# Altium project DCDC.PrjPcb (part 9 of 9)
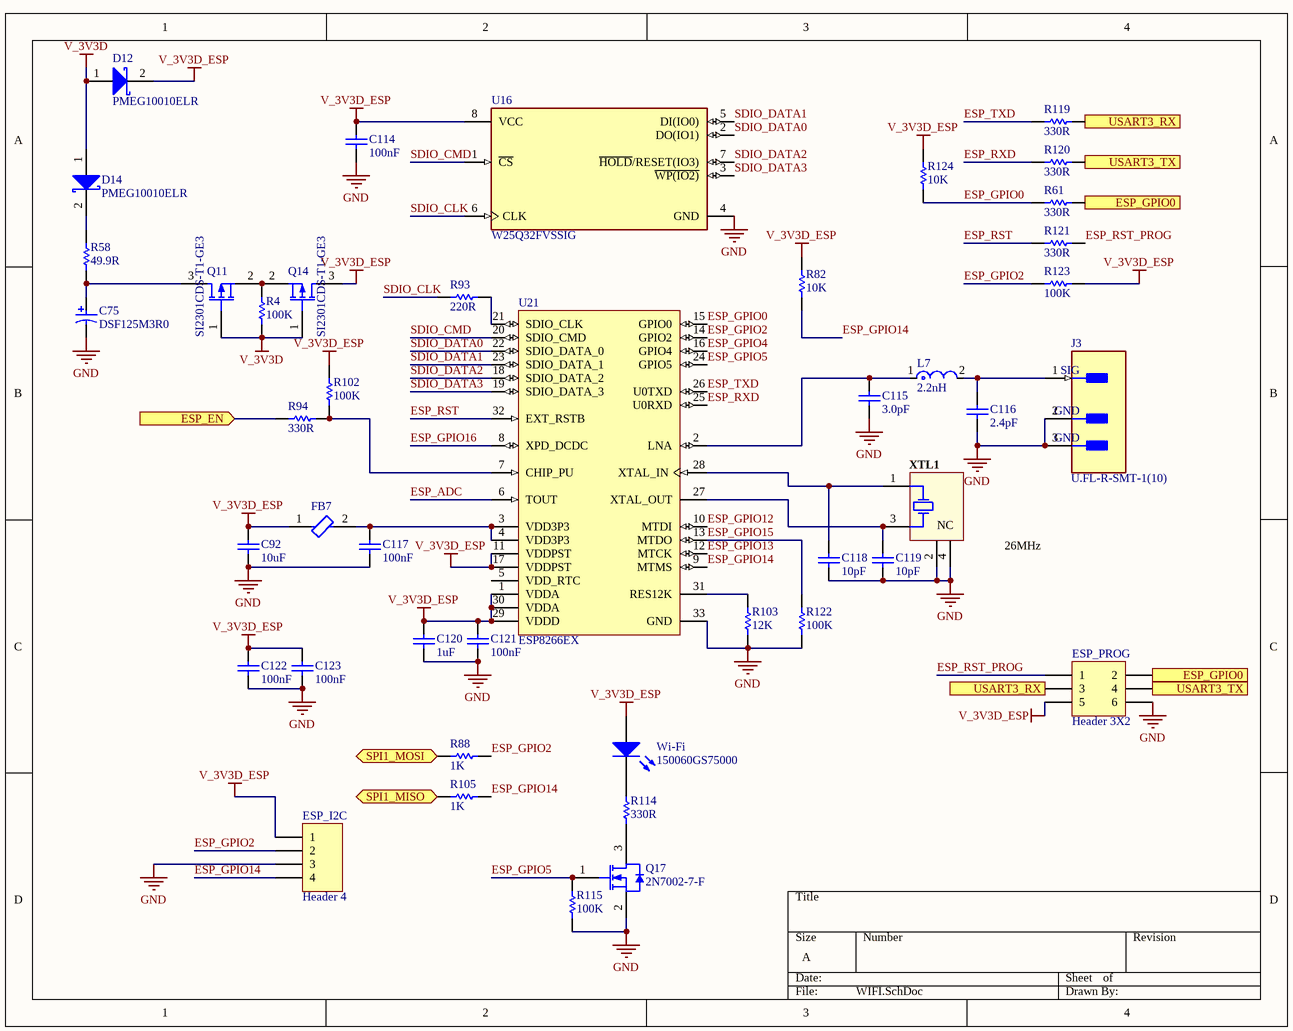
[diagram p15: WIFI.SchDoc]

## Sheet WIFI.SchDoc (continued)

### Library data of the parts
C75 = CMP-1665-00015-4: Aluminum Electrolytic Capacitor (Radial Lead Type), 100 uF, 35 V, -40 to 85 degC, 2-Pin THD, RoHS, Bulk; Manufacturer: Panasonic; Voltage Rating: 35 V; PackageReference: Radial; ComponentLink2URL: http://industrial.panasonic.com/cdbs/www-data/pdf/RDF0000/ABA0000C1047.pdf; DatasheetVersion: 03/2016; REACH SVHC: No SVHC; Mounting Technology: Through Hole; ComponentLink2Description: Datasheet; Packaging: Bulk; Lead Pitch: 2.5 mm; Height: 11.2 mm; Pins: 2; RoHSCompliant: true; Mount: Through Hole; Package Quantity: 200; Min Operating Temperature: -40 degC; Max Operating Temperature: 85 degC; PackageDescription: 2-Pin Through Hole Device, Dia 6.3 mm, Body Length 11.2 mm; ComponentLink1Description: Manufacturer URL; Length: 11.2 mm; ComponentLink1URL: http://www.panasonic.com/; Parameter 1: *; JLCPCB Part #: *
C92 = CMP-2007-03395-1: X5R 25V ±10% 10uF 0805 Multilayer Ceramic Capacitors MLCC - SMD/SMT ROHS; Part Number: GRM21BR71A106KE51L; Manufacturer: Murata; Parameter 1: *; JLCPCB Part #: C15850
C114 = CAP: X7R 100nF ±10% 50V 0603 Multilayer Ceramic Capacitors MLCC - SMD/SMT ROHS; Part Number: GCM188R72A104KA64D; Manufacturer: Murata; Manufacturer Part Number: CC0603KRX7R9BB104; Voltage Rating: 100V; Supplier 1: Arrow Electronics; Supplier Part Number 1: GCM188R72A104KA64D; RoHS: Yes; Category: Ceramic Capacitors; Mount: Surface Mount; Case/Package: 0603; Case Code (Imperial): 0603; Case Code (Metric): 1608; Min Operating Temperature: -55°C; Max Operating Temperature: 125°C; Tolerance: 10%; Packaging: Tape and Reel; Capacitance: 100nF; Dielectric: X7R; Termination: SMD/SMT; Voltage Rating (DC): 100V; Length: 1.6mm; Height: 0.8mm; Depth: 0.8mm; Radiation Hardening: No; ComponentLink1URL: https://datasheet.ciiva.com/17451/product-17451047.pdf?src-supplier=Avnet+Europe; ComponentLink1Description: https://datasheet.ciiva.com/17451/product-17451047.pdf?src-supplier=Avnet+Europe; ComponentLink2URL: https://datasheet.ciiva.com/26889/getdatasheetpartid-387765-26889164.pdf?src-supplier=Verical; ComponentLink2Description: https://datasheet.ciiva.com/26889/getdatasheetpartid-387765-26889164.pdf?src-supplier=Verical; Parameter 1: *; JLCPCB Part #: C14663
C115 = CMP-1034-00193-2: Part Number: GRM1555C1H2R4CA01D; Manufacturer: Murata; Capacitance: 2.4pF; Voltage Rating: 50V; Dielectric: C0G; Supplier 1: Digi-Key; Supplier Part Number 1: 490-5933-1-ND; Manufacturer Part Number: GRM1555C1H2R4CA01D; RoHS: Yes; Category: Ceramic Capacitors; Stock 1: 1106; Pricing 1: 1=0.10000, 10=0.03500, 50=0.01940, 100=0.01580, 500=0.01128, 1000=0.00886, 2500=0.00805, 5000=0.00741 (USD); Mount: Surface Mount; Case/Package: 0402; Case Code (Metric): 1005; Case Code (Imperial): 0402; Min Operating Temperature: -55°C; Max Operating Temperature: 125°C; Packaging: Tape and Reel; Package Quantity: 10000; Termination: SMD/SMT; Voltage Rating (DC): 50V; Series: GRM; Construction: Flat; Length: 1mm; Width: 0.02inch; Height: 0.5mm; Thickness: 0.022inch; Depth: 0.5mm; Radiation Hardening: No; Lead Free: Lead Free; RoHS Compliant: Yes; ComponentLink1URL: https://datasheet.ciiva.com/11614/product-11614787.pdf?src-supplier=Avnet; ComponentLink1Description: https://datasheet.ciiva.com/11614/product-11614787.pdf?src-supplier=Avnet; ComponentLink2URL: https://datasheet.ciiva.com/6271/grm1555c1h2r4ca01-01-6271124.pdf?src-supplier=Digi-Key; ComponentLink2Description: https://datasheet.ciiva.com/6271/grm1555c1h2r4ca01-01-6271124.pdf?src-supplier=Digi-Key; ComponentLink3URL: https://datasheet.ciiva.com/6271/partnumbering-e-01-6271126.pdf?src-supplier=Digi-Key; ComponentLink3Description: https://datasheet.ciiva.com/6271/partnumbering-e-01-6271126.pdf?src-supplier=Digi-Key; ComponentLink4URL: https://datasheet.ciiva.com/6271/partnumbering-e-01-6271129.pdf?src-supplier=Digi-Key; ComponentLink4Description: https://datasheet.ciiva.com/6271/partnumbering-e-01-6271129.pdf?src-supplier=Digi-Key; Parameter 1: *; JLCPCB Part #: *
C116 = CMP-1034-00193-2: Part Number: GRM1555C1H2R4CA01D; Manufacturer: Murata; Voltage Rating: 50V; Dielectric: C0G; Supplier 1: Digi-Key; Supplier Part Number 1: 490-5933-1-ND; Manufacturer Part Number: GRM1555C1H2R4CA01D; RoHS: Yes; Category: Ceramic Capacitors; Stock 1: 1106; Pricing 1: 1=0.10000, 10=0.03500, 50=0.01940, 100=0.01580, 500=0.01128, 1000=0.00886, 2500=0.00805, 5000=0.00741 (USD); Mount: Surface Mount; Case/Package: 0402; Case Code (Metric): 1005; Case Code (Imperial): 0402; Min Operating Temperature: -55°C; Max Operating Temperature: 125°C; Packaging: Tape and Reel; Capacitance: 2.4pF; Package Quantity: 10000; Termination: SMD/SMT; Voltage Rating (DC): 50V; Series: GRM; Construction: Flat; Length: 1mm; Width: 0.02inch; Height: 0.5mm; Thickness: 0.022inch; Depth: 0.5mm; Radiation Hardening: No; Lead Free: Lead Free; RoHS Compliant: Yes; ComponentLink1URL: https://datasheet.ciiva.com/11614/product-11614787.pdf?src-supplier=Avnet; ComponentLink1Description: https://datasheet.ciiva.com/11614/product-11614787.pdf?src-supplier=Avnet; ComponentLink2URL: https://datasheet.ciiva.com/6271/grm1555c1h2r4ca01-01-6271124.pdf?src-supplier=Digi-Key; ComponentLink2Description: https://datasheet.ciiva.com/6271/grm1555c1h2r4ca01-01-6271124.pdf?src-supplier=Digi-Key; ComponentLink3URL: https://datasheet.ciiva.com/6271/partnumbering-e-01-6271126.pdf?src-supplier=Digi-Key; ComponentLink3Description: https://datasheet.ciiva.com/6271/partnumbering-e-01-6271126.pdf?src-supplier=Digi-Key; ComponentLink4URL: https://datasheet.ciiva.com/6271/partnumbering-e-01-6271129.pdf?src-supplier=Digi-Key; ComponentLink4Description: https://datasheet.ciiva.com/6271/partnumbering-e-01-6271129.pdf?src-supplier=Digi-Key; Parameter 1: *; JLCPCB Part #: *
C117 C121-C123 = CMP-2008-02743-1: X7R 100nF ±10% 16V 0402 Multilayer Ceramic Capacitors MLCC - SMD/SMT ROHS; Manufacturer: AVX Interconnect / Elco; Part Number: 04026D104KAT2A; Voltage Rating: 6.3V; Dielectric: X5R; Supplier 1: Newark; Supplier Part Number 1: 34M9214; Manufacturer Part Number: 04026D104KAT2A; RoHS: Yes; Category: Ceramic Capacitors; Stock 1: 1436; Pricing 1: 10=0.02800, 25=0.02300, 50=0.01800, 100=0.01200, 250=0.01100, 500=0.00900, 1000=0.00700 (USD); Mount: Surface Mount; Case/Package: 0402; Case Code (Metric): 1005; Case Code (Imperial): 0402; Contact Plating: Tin,Matte; Dielectric Material: Ceramic; Min Operating Temperature: -55°C; Max Operating Temperature: 85°C; Package Quantity: 1; Packaging: Tape and Reel; Capacitance: 100nF; Tolerance: 10%; Voltage Rating (DC): 6.3V; Voltage: 6.3V; Termination: SMD/SMT; Series: -; Construction: Flat; Length: 1mm; Width: 0.02inch; Height: 0.56mm; Thickness: 0.022inch; Depth: 0.5mm; Radiation Hardening: No; REACH SVHC: No SVHC; Lead Free: Lead Free; RoHS Compliant: Yes; Parameter 1: *; JLCPCB Part #: C1525
C118 C119 = CMP-2008-04245-1: Part Number: GRM1555C1H100JA01D; Manufacturer: Murata; Material: Ceramic; Tolerance: 5%; Dielectric: C0G; Voltage Rating: 50V; Temperature Coefficient: 30ppm/°C; Supplier 1: Digi-Key; Supplier Part Number 1: 490-5921-1-ND; Manufacturer Part Number: GRM1555C1H100JA01D; RoHS: Yes; Category: Ceramic Capacitors; Stock 1: 1896512; Pricing 1: 1=0.10000, 10=0.01900, 50=0.01060, 100=0.00860, 500=0.00616, 1000=0.00484, 2500=0.00440, 5000=0.00405 (USD); Mount: Surface Mount; Case/Package: 0402; Number of Pins: 2; Case Code (Metric): 1005; Case Code (Imperial): 0402; Min Operating Temperature: -55°C; Max Operating Temperature: 125°C; Capacitance: 10pF; Packaging: Tape and Reel; Package Quantity: 10000; Voltage Rating (DC): 50V; Termination: SMD/SMT; Series: GRM; Construction: Flat; Voltage: 50V; Length: 1mm; Width: 0.02inch; Height: 0.5mm; Thickness: 0.022inch; Depth: 0.5mm; Radiation Hardening: No; RoHS Compliant: Yes; REACH SVHC: No SVHC; Lead Free: Lead Free; ComponentLink1URL: https://datasheet.ciiva.com/2989/product-2989280.pdf?src-supplier=Avnet; ComponentLink1Description: https://datasheet.ciiva.com/2989/product-2989280.pdf?src-supplier=Avnet; ComponentLink2URL: https://datasheet.ciiva.com/18184/getdatasheetpartid-307234-18184164.pdf?src-supplier=Verical; ComponentLink2Description: https://datasheet.ciiva.com/18184/getdatasheetpartid-307234-18184164.pdf?src-supplier=Verical; ComponentLink3URL: https://datasheet.ciiva.com/29200/453545-da-01-en-vs-kondensator-0402-29200107.pdf?src-supplier=Conrad; ComponentLink3Description: https://datasheet.ciiva.com/29200/453545-da-01-en-vs-kondensator-0402-29200107.pdf?src-supplier=Conrad; ComponentLink4URL: https://datasheet.ciiva.com/6271/partnumbering-e-01-6271158.pdf?src-supplier=Digi-Key; ComponentLink4Description: https://datasheet.ciiva.com/6271/partnumbering-e-01-6271158.pdf?src-supplier=Digi-Key; ComponentLink5URL: https://datasheet.ciiva.com/48671/product-48671350.pdf?src-supplier=Avnet; ComponentLink5Description: https://datasheet.ciiva.com/48671/product-48671350.pdf?src-supplier=Avnet; ComponentLink6URL: https://datasheet.ciiva.com/6271/partnumbering-e-01-6271159.pdf?src-supplier=Digi-Key; ComponentLink6Description: https://datasheet.ciiva.com/6271/partnumbering-e-01-6271159.pdf?src-supplier=Digi-Key; ComponentLink7URL: https://datasheet.ciiva.com/6271/partnumbering-e-01-6271068.pdf?src-supplier=Digi-Key; ComponentLink7Description: https://datasheet.ciiva.com/6271/partnumbering-e-01-6271068.pdf?src-supplier=Digi-Key; ComponentLink8URL: https://datasheet.ciiva.com/7828/1666664-7828812.pdf?src-supplier=Element14; ComponentLink8Description: https://datasheet.ciiva.com/7828/1666664-7828812.pdf?src-supplier=Element14; Parameter 1: *; JLCPCB Part #: *
C120 = CAP-NP-2: X5R ±10% 50V 1uF 0603 Multilayer Ceramic Capacitors MLCC - SMD/SMT ROHS; Manufacturer: AVX; Rated Voltage: 10V; Capacitance: 1µF; Datasheet Version: 10/2007; Mounting Technology: SurfaceMount; Datasheet URL: https://datasheet.ciiva.com/11787/0900766b80a45521-11787469.pdf; Tolerance (%): ±10%; Package Description: 2-Pin Surface Mount Device, Body 1.6 x 0.81 mm; Case Size/Dimension: 0603; Package Reference: 0603; Manufacturer URL: http://www.avx.com/; Dielectric: X5R; Parameter 1: *; JLCPCB Part #: C15849
D12 D14 = CMP-0303-00003-1: 1.0 A Surface Mount Schottky Barrier Rectifier, 40 V, -65 to 125 degC, 2-Pin SOD-123 Package, RoHS, Tape and Reel; PartNumber: 1N5819HW-7-F; Manufacturer: Diodes Inc; @ VR (V): 40; @ Terminal Temperature TT (degC): 90; Maximum Average Rectified Current IO (A): 1; Total Capacitance CT (pF): 50; Peak Forward Surge Current IFSM (A): 25; Forward Voltage Drop VF (V): 0.45; VR (RMS) (V): 28; RoHS: TRUE; ComponentLink2URL: http://www.diodes.com/datasheets/ds30217.pdf; PackageDescription: 2-Pin SOD-123, Body 2.7 x 1.55 mm, Pitch 3.7 mm; @ IF (A): 1; Operating and Storage Temperature Range: -65 to 125 degC; ComponentLink1Description: Manufacturer URL; ComponentLink2Description: Datasheet; ComponentLink1URL: http://www.diodes.com/; Mounting Technology: Surface Mount; DatasheetVersion: Rev. 15-2; PackageReference: SOD-123-2; Maximum Reverse Current IR (uA): 50; Peak Repetitive Reverse Voltage VRRM (V): 40; Packing: Tape and Reel; Parameter 1: *; JLCPCB Part #: C8598
ESP_I2C = Header 4: Header, 4-Pin; LatestRevisionDate: 17-Jul-2002; LatestRevisionNote: Re-released for DXP Platform.; Publisher: Altium Limited; Parameter 1: *; JLCPCB Part #: *
ESP_PROG = Header 3X2: Header, 3-Pin, Dual row; LatestRevisionDate: 17-Jul-2002; LatestRevisionNote: Re-released for DXP Platform.; Publisher: Altium Limited; Parameter 1: *; JLCPCB Part #: *
FB7 = CMP-0686-00187-4: Chip Ferrite Bead, 0402, 600Ω @ 100MHz, 0.52Ω, 25%, 300mA; DC Resistance-Max: 600mR; Number of Lines: 1; DC Resistance (DCR): 520mR; Shielding: Unshielded; Impedance: 600R; Material: Steel; Frequency: 100MHz; Lead Free: Lead Free; Max DC Current: 300mA; Test Frequency: 100MHz; Depth: 0.55mm; Length: 1mm; Case Code (Imperial): 0402; Packaging: Tape and Reel; Height: 0.5mm; Max Operating Temperature: 125°C; Military Standard: Not; REACH SVHC: No SVHC; Case Code (Metric): 1005; Series: BLM15AG_SN; Core Material: Ferrite; Termination: SMD/SMT; DC Current: 300mA; Package Quantity: 10000; Width: 0.5mm; RoHS Compliant: Yes; Min Operating Temperature: -55°C; Current Rating: 300mA; Case/Package: 0402; Number of Pins: 2; Radiation Hardening: No; Tolerance: 25%; Number of Circuits: 1; Max Current Rating: 300mA; Parameter 1: *; JLCPCB Part #: *
J3 = CMP-2000-05152-3: CONN U.FL RCPT STR 50 OHM SMD; Max Frequency: 6GHz; Connector Type: Coaxial; Body Plating: Silver; Body Material: Bronze; Impedance: 50R; Dielectric Material: Polymer; Insulation Resistance: 500MR; Gender: Male; Packaging: Cut Tape; Length: 3mm; Package Quantity: 2500; Termination: Solder; Lead Free: Lead Free; Series: U.FL; Min Operating Temperature: -40°C; Fastening Type: Snap; Contact Material: Brass; Orientation: Straight; Wire/Cable Type: Coaxial; Frequency: 6GHz; Contact Plating: Gold; Depth: 3.1mm; Weight: 0.001764oz; Max Operating Temperature: 90°C; Radiation Hardening: No; REACH SVHC: No SVHC; Mount: Surface Mount; Housing Color: Beige; Parameter 1: *; JLCPCB Part #: *
L7 = CMP-06042-005362-1: Multilayer type RF Inductor 1.6nH ±0.1nH 0.08Ω 1000mA 0402. LQP15MN1N6B02; Manufacturer: Murata; Manufacturer Part Number: LQP15MN1N6B02D; Self Resonant Frequency: 6GHz; Current: 300mA; Q Factor: 8; Core Material: Air; Test Frequency: 100MHz; Shielding: Unshielded; DC Resistance (DCR): 100mR; Number of Pins: 2; Mount: Surface Mount; Case Code (Metric): 1005; Min Operating Temperature: -55°C; Height - Seated (Max): 0.022inch; Termination: SMD/SMT; Packaging: Tape and Reel; Depth: 0.55mm; Max DC Current: 300mA; Case Code (Imperial): 0402; REACH SVHC: No SVHC; Width: 0.02inch; Height: 0.5mm; Package Quantity: 10000; Military Standard: Not; Lead Free: Lead Free; Inductance: 1.6nH; DC Current: 300mA; Radiation Hardening: No; Case/Package: 0402; Current Rating: 300mA; Max Operating Temperature: 125°C; Length: 1mm; Supplier 1: Digi-Key; Supplier Part Number 1: 490-6749-1-ND; RoHS: Yes; Category: Fixed Inductors; Stock 1: 8246; Pricing 1: 1=0.18000, 10=0.15800, 25=0.14040, 50=0.11920, 100=0.10520, 250=0.09644, 500=0.08768, 1000=0.07365, 2500=0.06313 (USD); Resistor Type: Thin Film; Series: LQP15M; Technology: THIN FILM; RoHS Compliant: Yes; ComponentLink1URL: https://datasheet.ciiva.com/30490/0900766b81256025-30490361.pdf?src-supplier=RSComponents; ComponentLink1Description: https://datasheet.ciiva.com/30490/0900766b81256025-30490361.pdf?src-supplier=RSComponents; ComponentLink2URL: https://datasheet.ciiva.com/6705/l0075s0084lqp15m-6705206.pdf?src-supplier=Digi-Key; ComponentLink2Description: https://datasheet.ciiva.com/6705/l0075s0084lqp15m-6705206.pdf?src-supplier=Digi-Key; ComponentLink3URL: https://datasheet.ciiva.com/4978/product-4978215.pdf?src-supplier=Mouser; ComponentLink3Description: https://datasheet.ciiva.com/4978/product-4978215.pdf?src-supplier=Mouser; ComponentLink4URL: https://datasheet.ciiva.com/6705/l0075s0084lqp15m-6705209.pdf?src-supplier=Digi-Key; ComponentLink4Description: https://datasheet.ciiva.com/6705/l0075s0084lqp15m-6705209.pdf?src-supplier=Digi-Key; Parameter 1: *; JLCPCB Part #: *
Q11 Q14 = CMP-1099-00031-1: 0.112Ω 2.8A,4.5V 1V 250uA 3.1A 0.86W 20V P Channel SOT-23(SOT-23-3) MOSFETs ROHS; Manufacturer: Infineon; PartNumber: BSS83P; RDS (on) (max): 2,000Â mOhm; VGS(th) (min): -1Â V; VDS (max): -60Â V; Packing: Reel; VGS(th) (max): -2Â V; IDpuls (max): -1.32Â A; Green: TRUE; ID (max): -0.33Â A; QG: 2.38Â nC; Rth: 350Â K/W; RDS (on) (max) (@4.5V): 3,000Â mOhm; Pto t (max): 0.36Â W; PackageDescription: 3-Pin Small Outline Transistor Package, 2.9 x 1.3 mm Body, 0.95 mm Pitch; ComponentLink1Description: Manufacturer URL; Mounting Technology: Surface Mount; ComponentLink1URL: http://www.infineon.com/; ComponentLink3Description: Package Specification; PackageReference: PG-SOT23; Halogen-free: TRUE; ComponentLink3URL: http://www.infineon.com/dgdl/SOT23-Package_Overview.pdf?folderId=db3a30431936bc4b0119532290053c66&fileId=db3a30431936bc4b0119533468123c85; ComponentLink2Description: Datasheet; ComponentLink2URL: http://www.infineon.com/dgdl/BSS83P_Rev1.5.pdf?folderId=db3a3043156fd5730115d6a107c41454&fileId=db3a304330f686060131045ae20e3ea3; PackageVersion: Apr-08; DatasheetVersion: Rev. 1.5; Parameter 1: *; JLCPCB Part #: C10487
Q17 = CMP-2000-04929-1: N-Channel Enhancement Mode Field Effect Transistor, 60 V, 0.115 A, -55 to 150 degC, 3-Pin SOT23, RoHS, Tape and Reel; Id - Continuous Drain Current: 115mA; Typical Turn-On Delay Time: 7ns; Typical Turn-Off Delay Time: 11ns; Brand: DiodesIncorporated; Transistor Type: 1N-Channel; Vgs - Gate-Source Voltage: 20V; Rise Time: 3ns; Configuration: Single; Fall Time: 5.6ns; Vds - Drain-Source Breakdown Voltage: 70V; Rds On - Drain-Source Resistance: 7.5Ohms; Number of Channels: 1Channel; Forward Transconductance - Min: 0.08S; Pd - Power Dissipation: 300mW; Unit Weight: 0.000282oz; Datasheet URL: http://datasheet.octopart.com/2N7002-7-F-Diodes-Inc.-datasheet-8326113.pdf; Width: 1.3mm; Series: 2N7002; Length: 2.9mm; Product Category: MOSFET; Minimum Operating Temperature: -55C; Manufacturer URL: http://www.diodes.com/; Mounting Style: SMD/SMT; Package Reference: SOT23-3; Package Description: 3-Pin Small Outline Transistor, Body 2.9 x 1.3 mm, Pitch 0.96 mm; Maximum Operating Temperature: +150C; Transistor Polarity: N-Channel; Factory Pack Quantity: 3000; Technology: Si; Channel Mode: Enhancement; Datasheet Version: Rev. 21-2, 02/2009; Type: EnhancementModeFieldEffectTransistor; RoHS: True; Packaging: Reel; Package / Case: SOT-23-3; Height: 1mm; Product: MOSFETSmallSignal; Manufacturer: DiodesIncorporated; Parameter 1: *; JLCPCB Part #: C8545
R4 R102 R115 = CMP-2000-06953-1: ±1% 100kΩ ±100ppm/℃ 0.1W 0603 Chip Resistor - Surface Mount ROHS; Manufacturer: Yageo; Manufacturer Part Number: RC0603JR-071ML; Power Rating: 100mW; Resistance Tolerance: ±5%; Product Range: RCSeries; Temperature Coefficient: ±100ppm/°C; Resistor Element Type: ThickFilm; Resistance: 1Mohm; SVHC: ToBeAdvised; Voltage Rating: 50V; Resistor Case Style: 0603[1608Metric]; Tolerance: 5%; MSL: MSL1-Unlimited; Package Description: 2-Pin Surface Mount Device, Body 1.6 x 0.8 mm; Datasheet Version: Rev. 7, 05/2017; Datasheet URL: http://www.yageo.com/documents/recent/PYu-RC_Group_51_RoHS_L_7.pdf; Manufacturer URL: http://www.yageo.com/; Package Reference: 0603; Automotive Qualification Standard: -; Packaging: CutTape; Mounting Technology: SurfaceMount; Supplier 1: Digi-Key; Supplier Part Number 1: 311-1.0MGRCT-ND; Stock 1: 3949362; Pricing 1: 1=0,10000, 10=0,01900, 100=0,00770, 1000=0,00347, 2500=0,00301 (USD); RoHS: Yes; Case/Package: 0603; Number of Pins: 2; Case Code (Imperial): 0603; Case Code (Metric): 1608; Contact Plating: Tin,Matte; Min Operating Temperature: -55°C; Max Operating Temperature: 155°C; Composition: Thick Film; Termination: SMD/SMT; Package Quantity: 5000; Military Standard: Not; Voltage Rating (DC): 50V; Length: 1.6mm; Height: 0.45mm; Width: 0.8mm; Depth: 0.8mm; Radiation Hardening: No; Lead Free: Lead Free; REACH SVHC: No SVHC; ComponentLink1URL: https://datasheet.ciiva.com/46395/443971-46395067.pdf?src-supplier=Element14; ComponentLink1Description: https://datasheet.ciiva.com/46395/443971-46395067.pdf?src-supplier=Element14; ComponentLink2URL: https://datasheet.ciiva.com/8883/pyu-rc0603-51-rohs-l-4-8883053.pdf?src-supplier=Avnet; ComponentLink2Description: https://datasheet.ciiva.com/8883/pyu-rc0603-51-rohs-l-4-8883053.pdf?src-supplier=Avnet; ComponentLink3URL: https://datasheet.ciiva.com/12555/rc0603-272842-12555342.pdf?src-supplier=Mouser; ComponentLink3Description: https://datasheet.ciiva.com/12555/rc0603-272842-12555342.pdf?src-supplier=Mouser; ComponentLink4URL: https://datasheet.ciiva.com/7746/443971-7746463.pdf?src-supplier=Element14; ComponentLink4Description: https://datasheet.ciiva.com/7746/443971-7746463.pdf?src-supplier=Element14; Parameter 1: *; JLCPCB Part #: C25803
R58 = CMP-2000-00538-1: ±1% ±200ppm/℃ 0.1W 49.9Ω 0603 Chip Resistor - Surface Mount ROHS; Manufacturer: Panasonic; Part Number: ERJ-3EKF49R9V; Manufacturer Part Number: ERJ3EKF49R9V; Power Rating: 100mW; Voltage Rating: 75V; Temperature Coefficient: 100ppm/°C; Voltage Rating (DC): 50V; Working Voltage: 6V; Supplier 1: RSComponents; Supplier Part Number 1: 1229343; RoHS: Yes; Category: Chip SMD Resistors; Stock 1: 1; Pricing 1: 5000=0.00700 (USD); Mount: Surface Mount; Case/Package: 0603; Case Code (Imperial): 0603; Case Code (Metric): 1608; Contact Plating: Tin; Min Operating Temperature: -55°C; Max Operating Temperature: 155°C; Packaging: Tape and Reel; Resistance: 49.9R; Tolerance: 1%; Resistor Type: Thick Film; Number of Terminations: 2; Termination: SMD/SMT; Max Power Dissipation: 100mW; Series: ERJ; Package Quantity: 5000; Resistance Tolerance: 1%; Features: Automotive AEC-Q200; Construction: Rectangular; Technology: THICK FILM; Length: 1.6mm; Width: 0.8mm; Height: 0.022inch; Depth: 0.8mm; Radiation Hardening: No; REACH SVHC: Unknown; Lead Free: Lead Free; RoHS Compliant: Yes; Military Standard: Not; ComponentLink1URL: https://datasheet.ciiva.com/46388/1678782-46388908.pdf?src-supplier=Element14; ComponentLink1Description: https://datasheet.ciiva.com/46388/1678782-46388908.pdf?src-supplier=Element14; ComponentLink2URL: https://datasheet.ciiva.com/28694/1678782-28694219.pdf?src-supplier=Element14; ComponentLink2Description: https://datasheet.ciiva.com/28694/1678782-28694219.pdf?src-supplier=Element14; ComponentLink3URL: https://datasheet.ciiva.com/16772/70260748-16772570.pdf?src-supplier=Allied+Electronics; ComponentLink3Description: https://datasheet.ciiva.com/16772/70260748-16772570.pdf?src-supplier=Allied+Electronics; ComponentLink4URL: https://datasheet.ciiva.com/16766/70260748-16766262.pdf?src-supplier=Allied+Electronics; ComponentLink4Description: https://datasheet.ciiva.com/16766/70260748-16766262.pdf?src-supplier=Allied+Electronics; ComponentLink5URL: https://datasheet.ciiva.com/9117/aoa0000ce2-9117128.pdf?src-supplier=Avnet; ComponentLink5Description: https://datasheet.ciiva.com/9117/aoa0000ce2-9117128.pdf?src-supplier=Avnet; ComponentLink6URL: https://datasheet.ciiva.com/48531/aoa0000ce2-48531019.pdf?src-supplier=Avnet; ComponentLink6Description: https://datasheet.ciiva.com/48531/aoa0000ce2-48531019.pdf?src-supplier=Avnet; ComponentLink7URL: https://datasheet.ciiva.com/30095/aoa0000ce2-30095355.pdf?src-supplier=Onlinecomponents.com; ComponentLink7Description: https://datasheet.ciiva.com/30095/aoa0000ce2-30095355.pdf?src-supplier=Onlinecomponents.com; Parameter 1: *; JLCPCB Part #: C23185
R61 R119-R121 = RES-2: ±1% 330Ω ±100ppm/℃ 0.1W 0603 Chip Resistor - Surface Mount ROHS; Tolerance: 10%; ESR: 800 mohm; Voltage Rating (DC): 16 V; Capacitance: 47 uF; Length: 7.3 mm; ComponentLink1URL: http://www.yageo.com/; Packaging: Tape and Reel; Pins: 2; ComponentLink1Description: Manufacturer URL; Case Code (Imperial): 2917; REACH SVHC: No SVHC; Width: 4.3 mm; ComponentLink2Description: Datasheet; Voltage Rating: 16 V; RoHSCompliant: True; Max Operating Temperature: 125degC; ComponentLink2URL: http://www.yageo.com/documents/recent/PYu-RC_Group_51_RoHS_L_04.pdf; Min Operating Temperature: -55degC; Case/Package: 2917; Radiation Hardening: No; DatasheetVersion: Rev. 4, 02/2016; Mount: Surface Mount; PackageReference: 0603; Package Quantity: 500; Case Code (Metric): 7343; PackageDescription: 2-Pin Surface Mount Device, Body 1.6 x 0.8 mm; Height: 3.1 mm; Parameter 1: *; JLCPCB Part #: C23138
R82 = CMP-2002-07343-1: 1/16W ±1% ±100ppm/℃ 10kΩ 0402 Chip Resistor - Surface Mount ROHS; Part Number: RC0402FR-07100KL; Manufacturer: Yageo / Phycomp; Power Rating: 63mW; Resistance: 100kR; Temperature Coefficient: 100ppm/°C; Voltage Rating: 50V; Supplier 1: Digi-Key; Supplier Part Number 1: 311-100KLRCT-ND; Manufacturer Part Number: RC0402FR-07100KL; RoHS: Yes; Category: Chip SMD Resistors; Stock 1: 17727422; Pricing 1: 1=0.10000, 10=0.01600, 100=0.00640, 1000=0.00286, 2500=0.00248, 5000=0.00205 (USD); Case/Package: 0402; Case Code (Metric): 1005; Case Code (Imperial): 0402; Min Operating Temperature: -55°C; Max Operating Temperature: 155°C; Tolerance: 1%; Packaging: Tape and Reel; Max Power Dissipation: 63mW; Series: RC; Package Quantity: 1; Termination: SMD/SMT; Resistance Tolerance: 1%; Resistor Type: Thick Film; Number of Terminations: 2; Construction: Rectangular; Features: Moisture Resistant; Technology: THICK FILM; Working Voltage: 50V; Length: 0.039inch; Width: 0.02inch; Height: 0.016inch; Depth: 0.5mm; RoHS Compliant: Yes; REACH SVHC: No SVHC; Military Standard: Not; Lead Free: Lead Free; ComponentLink1URL: https://datasheet.ciiva.com/11819/0900766b80c66297-11819452.pdf?src-supplier=RSComponents; ComponentLink1Description: https://datasheet.ciiva.com/11819/0900766b80c66297-11819452.pdf?src-supplier=RSComponents; ComponentLink2URL: https://datasheet.ciiva.com/2453/pyu-r-int-thick-7-2453361.pdf?src-supplier=Digi-Key; ComponentLink2Description: https://datasheet.ciiva.com/2453/pyu-r-int-thick-7-2453361.pdf?src-supplier=Digi-Key; ComponentLink3URL: https://datasheet.ciiva.com/2453/pyu-r-int-thick-7-2453362.pdf?src-supplier=Digi-Key; ComponentLink3Description: https://datasheet.ciiva.com/2453/pyu-r-int-thick-7-2453362.pdf?src-supplier=Digi-Key; ComponentLink4URL: https://datasheet.ciiva.com/2453/pyu-r-int-thick-7-2453363.pdf?src-supplier=Digi-Key; ComponentLink4Description: https://datasheet.ciiva.com/2453/pyu-r-int-thick-7-2453363.pdf?src-supplier=Digi-Key; ComponentLink5URL: https://datasheet.ciiva.com/22747/1018594-22747509.pdf?src-supplier=Element14; ComponentLink5Description: https://datasheet.ciiva.com/22747/1018594-22747509.pdf?src-supplier=Element14; ComponentLink6URL: https://datasheet.ciiva.com/15189/getdatasheetpartid-323696-15189334.pdf?src-supplier=Verical; ComponentLink6Description: https://datasheet.ciiva.com/15189/getdatasheetpartid-323696-15189334.pdf?src-supplier=Verical; ComponentLink7URL: https://datasheet.ciiva.com/12667/pyu-rc0402-51-rohs-l-6-r-12667930.pdf?src-supplier=Mouser; ComponentLink7Description: https://datasheet.ciiva.com/12667/pyu-rc0402-51-rohs-l-6-r-12667930.pdf?src-supplier=Mouser; Parameter 1: *; JLCPCB Part #: C25744
R88 R105 = CMP-2002-07472-1: ±1% 1/16W ±100ppm/℃ 1kΩ 0402 Chip Resistor - Surface Mount ROHS; Part Number: RC0402FR-071KL; Manufacturer: Yageo / Phycomp; Resistance: 1kR; Power Rating: 62.5mW; Voltage Rating: 50V; Temperature Coefficient: 100ppm/°C; Max Power Dissipation: 63mW; Supplier 1: Digi-Key; Supplier Part Number 1: 311-1.00KLRCT-ND; Manufacturer Part Number: RC0402FR-071KL; RoHS: Yes; Category: Chip SMD Resistors; Stock 1: 21620273; Pricing 1: 1=0.10000, 10=0.01600, 100=0.00660, 1000=0.00299, 2500=0.00259, 5000=0.00214 (USD); Case/Package: 0402; Number of Pins: 2; Case Code (Imperial): 0402; Case Code (Metric): 1005; Size Code: 0402; Min Operating Temperature: -55°C; Max Operating Temperature: 155°C; Packaging: Tape and Reel; Termination: SMD/SMT; Tolerance: 1%; Series: RC; Resistor Type: Thick Film; Number of Terminations: 2; Resistance Tolerance: 1%; Construction: Rectangular; Features: Moisture Resistant; Voltage Rating (DC): 50V; Technology: THICK FILM; Length: 1mm; Width: 0.5mm; Height: 0.32mm; Depth: 0.5mm; REACH SVHC: Unknown; Military Standard: Not; RoHS Compliant: Yes; Lead Free: Lead Free; ComponentLink1URL: https://datasheet.ciiva.com/11819/0900766b80c66297-11819477.pdf?src-supplier=RSComponents; ComponentLink1Description: https://datasheet.ciiva.com/11819/0900766b80c66297-11819477.pdf?src-supplier=RSComponents; ComponentLink2URL: https://datasheet.ciiva.com/12666/pyu-rc0402-51-rohs-l-6-r-12666741.pdf?src-supplier=Mouser; ComponentLink2Description: https://datasheet.ciiva.com/12666/pyu-rc0402-51-rohs-l-6-r-12666741.pdf?src-supplier=Mouser; ComponentLink3URL: https://datasheet.ciiva.com/17063/pyu-rc0402-51-rohs-l-6-r-17063193.pdf?src-supplier=Future+Electronics; ComponentLink3Description: https://datasheet.ciiva.com/17063/pyu-rc0402-51-rohs-l-6-r-17063193.pdf?src-supplier=Future+Electronics; ComponentLink4URL: https://datasheet.ciiva.com/22747/1018594-22747513.pdf?src-supplier=Element14; ComponentLink4Description: https://datasheet.ciiva.com/22747/1018594-22747513.pdf?src-supplier=Element14; ComponentLink5URL: https://datasheet.ciiva.com/7849/1018594-7849869.pdf?src-supplier=Element14; ComponentLink5Description: https://datasheet.ciiva.com/7849/1018594-7849869.pdf?src-supplier=Element14; ComponentLink6URL: https://datasheet.ciiva.com/7983/1018594-7983502.pdf?src-supplier=Element14; ComponentLink6Description: https://datasheet.ciiva.com/7983/1018594-7983502.pdf?src-supplier=Element14; ComponentLink7URL: https://datasheet.ciiva.com/7849/1018594-7849871.pdf?src-supplier=Element14; ComponentLink7Description: https://datasheet.ciiva.com/7849/1018594-7849871.pdf?src-supplier=Element14; Parameter 1: *; JLCPCB Part #: C11702
R93 = CMP-2002-07498-1: 1/16W ±1% ±100ppm/℃ 220Ω 0402 Chip Resistor - Surface Mount ROHS; Manufacturer: Yageo / Phycomp; Part Number: RC0402FR-07200RL; Resistance: 200R; Temperature Coefficient: 100ppm/°C; Power Rating: 63mW; Voltage Rating: 50V; Supplier 1: RSComponents; Supplier Part Number 1: 1987691; Manufacturer Part Number: RC0402FR-07200RL; RoHS: Yes; Category: Chip SMD Resistors; Stock 1: 12900; Pricing 1: 10000=0.00300 (GBP); Case/Package: 0402; Case Code (Metric): 1005; Case Code (Imperial): 0402; Size Code: 0402; Min Operating Temperature: -55°C; Max Operating Temperature: 155°C; Tolerance: 1%; Packaging: Tape and Reel; Resistor Type: Thick Film; Series: RC; Number of Terminations: 2; Termination: SMD/SMT; Max Power Dissipation: 63mW; Voltage Rating (DC): 50V; Resistance Tolerance: 1%; Package Quantity: 1; Features: Moisture Resistant; Construction: Rectangular; Length: 1mm; Width: 0.02inch; Height: 0.016inch; Depth: 0.5mm; RoHS Compliant: Yes; REACH SVHC: No SVHC; Lead Free: Lead Free; Military Standard: Not; ComponentLink1URL: https://datasheet.ciiva.com/2553/pyu-r-int-thick-7-2553232.pdf?src-supplier=Digi-Key; ComponentLink1Description: https://datasheet.ciiva.com/2553/pyu-r-int-thick-7-2553232.pdf?src-supplier=Digi-Key; ComponentLink2URL: https://datasheet.ciiva.com/7983/1018594-7983509.pdf?src-supplier=Element14; ComponentLink2Description: https://datasheet.ciiva.com/7983/1018594-7983509.pdf?src-supplier=Element14; ComponentLink3URL: https://datasheet.ciiva.com/16804/pyu-rc0402-51-rohs-l-6-r-16804406.pdf?src-supplier=Future+Electronics; ComponentLink3Description: https://datasheet.ciiva.com/16804/pyu-rc0402-51-rohs-l-6-r-16804406.pdf?src-supplier=Future+Electronics; ComponentLink4URL: https://datasheet.ciiva.com/15189/getdatasheetpartid-331152-15189383.pdf?src-supplier=Verical; ComponentLink4Description: https://datasheet.ciiva.com/15189/getdatasheetpartid-331152-15189383.pdf?src-supplier=Verical; ComponentLink5URL: https://datasheet.ciiva.com/7849/1018594-7849898.pdf?src-supplier=Element14; ComponentLink5Description: https://datasheet.ciiva.com/7849/1018594-7849898.pdf?src-supplier=Element14; ComponentLink6URL: https://datasheet.ciiva.com/5562/pyu-rc0402-51-rohs-l-6-r-8721-5562539.pdf?src-supplier=Mouser; ComponentLink6Description: https://datasheet.ciiva.com/5562/pyu-rc0402-51-rohs-l-6-r-8721-5562539.pdf?src-supplier=Mouser; ComponentLink7URL: https://datasheet.ciiva.com/7849/1018594-7849899.pdf?src-supplier=Element14; ComponentLink7Description: https://datasheet.ciiva.com/7849/1018594-7849899.pdf?src-supplier=Element14; ComponentLink8URL: https://datasheet.ciiva.com/2553/pyu-r-int-thick-7-2553230.pdf?src-supplier=Digi-Key; ComponentLink8Description: https://datasheet.ciiva.com/2553/pyu-r-int-thick-7-2553230.pdf?src-supplier=Digi-Key; ComponentLink9URL: https://datasheet.ciiva.com/2553/pyu-r-int-thick-7-2553231.pdf?src-supplier=Digi-Key; ComponentLink9Description: https://datasheet.ciiva.com/2553/pyu-r-int-thick-7-2553231.pdf?src-supplier=Digi-Key; Parameter 1: *; JLCPCB Part #: C25091
R94 R114 = RES-2: ±1% 330Ω ±100ppm/℃ 0.1W 0603 Chip Resistor - Surface Mount ROHS; Manufacturer: Yageo; Manufacturer Part Number: RC0603FR-07330RL; Tolerance: 10%; ESR: 800 mohm; Voltage Rating (DC): 16 V; Capacitance: 47 uF; Temperature Coefficient: 100ppm/°C; Power Rating: 100mW; Length: 7.3 mm; ComponentLink1URL: http://www.yageo.com/; Packaging: Tape and Reel; Pins: 2; ComponentLink1Description: Manufacturer URL; Case Code (Imperial): 2917; REACH SVHC: No SVHC; Width: 4.3 mm; ComponentLink2Description: Datasheet; Voltage Rating: 16 V; RoHSCompliant: True; Max Operating Temperature: 125degC; ComponentLink2URL: http://www.yageo.com/documents/recent/PYu-RC_Group_51_RoHS_L_04.pdf; Min Operating Temperature: -55degC; Case/Package: 2917; Radiation Hardening: No; DatasheetVersion: Rev. 4, 02/2016; Mount: Surface Mount; PackageReference: 0603; Package Quantity: 500; Case Code (Metric): 7343; PackageDescription: 2-Pin Surface Mount Device, Body 1.6 x 0.8 mm; Height: 3.1 mm; Supplier 1: Digi-Key; Supplier Part Number 1: 311-330HRCT-ND; RoHS: Yes; Category: Chip SMD Resistors; Stock 1: 4209654; Pricing 1: 1=0.10000, 10=0.02300, 100=0.00940, 1000=0.00421, 2500=0.00366 (USD); Number of Pins: 2; Composition: Thick Film; Resistance: 330R; Number of Terminations: 2; Max Power Dissipation: 100mW; Termination: SMD/SMT; Features: Moisture Resistant; Depth: 0.8mm; Lead Free: Lead Free; ComponentLink3URL: https://datasheet.ciiva.com/11819/0900766b80f96399-11819327.pdf?src-supplier=RSComponents; ComponentLink3Description: https://datasheet.ciiva.com/11819/0900766b80f96399-11819327.pdf?src-supplier=RSComponents; ComponentLink4URL: https://datasheet.ciiva.com/2454/pyu-r-int-thick-7-2454864.pdf?src-supplier=Digi-Key; ComponentLink4Description: https://datasheet.ciiva.com/2454/pyu-r-int-thick-7-2454864.pdf?src-supplier=Digi-Key; ComponentLink5URL: https://datasheet.ciiva.com/2454/pyu-r-int-thick-7-2454865.pdf?src-supplier=Digi-Key; ComponentLink5Description: https://datasheet.ciiva.com/2454/pyu-r-int-thick-7-2454865.pdf?src-supplier=Digi-Key; ComponentLink6URL: https://datasheet.ciiva.com/2454/pyu-r-int-thick-7-2454866.pdf?src-supplier=Digi-Key; ComponentLink6Description: https://datasheet.ciiva.com/2454/pyu-r-int-thick-7-2454866.pdf?src-supplier=Digi-Key; ComponentLink7URL: https://datasheet.ciiva.com/12555/rc0603-272842-12555334.pdf?src-supplier=Mouser; ComponentLink7Description: https://datasheet.ciiva.com/12555/rc0603-272842-12555334.pdf?src-supplier=Mouser; ComponentLink8URL: https://datasheet.ciiva.com/46440/1868787-46440904.pdf?src-supplier=Element14; ComponentLink8Description: https://datasheet.ciiva.com/46440/1868787-46440904.pdf?src-supplier=Element14; ComponentLink9URL: https://datasheet.ciiva.com/7746/443971-7746329.pdf?src-supplier=Element14; ComponentLink9Description: https://datasheet.ciiva.com/7746/443971-7746329.pdf?src-supplier=Element14; ComponentLink10URL: https://datasheet.ciiva.com/7746/443971-7746330.pdf?src-supplier=Element14; ComponentLink10Description: https://datasheet.ciiva.com/7746/443971-7746330.pdf?src-supplier=Element14; ComponentLink11URL: https://datasheet.ciiva.com/7746/1686128-7746331.pdf?src-supplier=Element14; ComponentLink11Description: https://datasheet.ciiva.com/7746/1686128-7746331.pdf?src-supplier=Element14; Parameter 1: *; JLCPCB Part #: C23138
R103 = CMP-2002-00646-4: Chip Resistor, 12 KOhm, +/- 1%, 0.1 W, -55 to 155 degC, 0402 (1005 Metric), RoHS, Tape and Reel; PartNumber: ERJ-2RKF1202X; Manufacturer: Panasonic; Resistance: 12 KOhm; Voltage Rating: 50 V; Case\/Package: 0402; Power Rating: 100 mW; Temperature Coefficient: 100ppm/°C; Max Power Dissipation: 100mW; Voltage Rating (DC): 50V; Length: 1 mm; PackageReference: 0402; DatasheetVersion: 04/2015; ComponentLink2Description: Datasheet; ComponentLink1URL: http://www.panasonic.com/; Pins: 2; Width: 0.5 mm; REACH SVHC: Yes; Packaging: Tape and Reel; Min Operating Temperature: -55 degC; Mounting Technology: Surface Mount; Max Operating Temperature: 155 degC; Case Code (Imperial): 0402; Height: 0.35 mm; Tolerance: 1%; PackageDescription: 2-Pin Surface Mount Device, Body 1 x 0.5 mm; RoHSCompliant: true; ComponentLink1Description: Manufacturer URL; Mount: Surface Mount; ComponentLink2URL: http://industrial.panasonic.com/cdbs/www-data/pdf/RDA0000/AOA0000C86.pdf; Package Quantity: 10000; Case Code (Metric): 1005; Supplier 1: RSComponents; Supplier Part Number 1: 1755721; Manufacturer Part Number: ERJ-2RKF1202X; RoHS: Yes; Category: Chip SMD Resistors; Stock 1: 415800; Pricing 1: 10000=0.00400, 10000=0.00300 (USD); Case/Package: 0402; Number of Pins: 2; Contact Plating: Tin; Size Code: 0402; Resistor Type: Thick Film; Series: ERJ; Number of Terminations: 2; Termination: SMD/SMT; Resistance Tolerance: 1%; Construction: Rectangular; Features: Automotive AEC-Q200; Technology: THICK FILM; Depth: 0.5mm; RoHS Compliant: Yes; Military Standard: Not; Lead Free: Lead Free; ComponentLink3URL: https://datasheet.ciiva.com/11821/0900766b80f80784-11821195.pdf?src-supplier=RSComponents; ComponentLink3Description: https://datasheet.ciiva.com/11821/0900766b80f80784-11821195.pdf?src-supplier=RSComponents; ComponentLink4URL: https://datasheet.ciiva.com/7944/aoa0000ce2-7944604.pdf?src-supplier=Element14; ComponentLink4Description: https://datasheet.ciiva.com/7944/aoa0000ce2-7944604.pdf?src-supplier=Element14; ComponentLink5URL: https://datasheet.ciiva.com/7944/426256-7944939.pdf?src-supplier=Element14; ComponentLink5Description: https://datasheet.ciiva.com/7944/426256-7944939.pdf?src-supplier=Element14; ComponentLink6URL: https://datasheet.ciiva.com/46373/1678782-46373164.pdf?src-supplier=Element14; ComponentLink6Description: https://datasheet.ciiva.com/46373/1678782-46373164.pdf?src-supplier=Element14; ComponentLink7URL: https://datasheet.ciiva.com/22673/1678782-22673676.pdf?src-supplier=Element14; ComponentLink7Description: https://datasheet.ciiva.com/22673/1678782-22673676.pdf?src-supplier=Element14; ComponentLink8URL: https://datasheet.ciiva.com/22687/1678782-22687405.pdf?src-supplier=Element14; ComponentLink8Description: https://datasheet.ciiva.com/22687/1678782-22687405.pdf?src-supplier=Element14; ComponentLink9URL: https://datasheet.ciiva.com/46373/1678782-46373165.pdf?src-supplier=Element14; ComponentLink9Description: https://datasheet.ciiva.com/46373/1678782-46373165.pdf?src-supplier=Element14; ComponentLink10URL: https://datasheet.ciiva.com/16397/aoa0000ce2-16397589.pdf?src-supplier=Future+Electronics; ComponentLink10Description: https://datasheet.ciiva.com/16397/aoa0000ce2-16397589.pdf?src-supplier=Future+Electronics; ComponentLink11URL: https://datasheet.ciiva.com/30102/aoa0000ce2-30102936.pdf?src-supplier=Onlinecomponents.com; ComponentLink11Description: https://datasheet.ciiva.com/30102/aoa0000ce2-30102936.pdf?src-supplier=Onlinecomponents.com; Parameter 1: *; JLCPCB Part #: C25752
R122 R123 = CMP-2100-03662-1: ±1% 100kΩ ±100ppm/℃ 0.1W 0603 Chip Resistor - Surface Mount ROHS; Manufacturer: Yageo; Manufacturer Part Number: RC0603FR-07100KL; Power Rating: 100mW; Voltage Rating: 50V; Resistance: 100KOhm; Temperature Coefficient: 100ppm/degreesC; Working Voltage: 75V; Datasheet Version: Rev. 5, 10/2016; Height: 0.45mm; Lead Free: LeadFree; Manufacturer URL: http://www.yageo.com/; Package Reference: 0603; Depth: 0.8mm; RoHSCompliant: true; Composition: ThickFilm; Military Standard: Not; Case/Package: 0603; Packaging: TapeandReel; Case Code (Imperial): 0603; Voltage Rating (DC): 50V; Case Code (Metric): 1608; Tolerance: 1%; Termination: SMD/SMT; Min Operating Temperature: -55degC; Number of Pins: 2; Length: 1.6mm; Width: 0.8mm; Datasheet URL: http://www.yageo.com/NewPortal/yageodocoutput?fileName=/pdf/R-Chip/PYu-RC_Group_51_RoHS_L_5.pdf; Package Description: 2-Pin Surface Mount Device, Body 1.6 x 0.8 mm; Max Operating Temperature: 155degC; REACH SVHC: NoSVHC; Supplier 1: Digi-Key; Supplier Part Number 1: 311-100KHRCT-ND; RoHS: Yes; Category: Chip SMD Resistors; Stock 1: 19283456; Pricing 1: 1=0.10000, 10=0.02400, 100=0.00970, 1000=0.00436, 2500=0.00378 (USD); Series: RC; Max Power Dissipation: 100mW; Resistor Type: Thick Film; Number of Terminations: 2; Resistance Tolerance: 1%; Features: Moisture Resistant; Construction: Rectangular; Technology: THICK FILM; RoHS Compliant: Yes; ComponentLink1URL: https://datasheet.ciiva.com/11808/0900766b80f96399-11808107.pdf?src-supplier=RSComponents; ComponentLink1Description: https://datasheet.ciiva.com/11808/0900766b80f96399-11808107.pdf?src-supplier=RSComponents; ComponentLink2URL: https://datasheet.ciiva.com/7983/443971-7983593.pdf?src-supplier=Element14; ComponentLink2Description: https://datasheet.ciiva.com/7983/443971-7983593.pdf?src-supplier=Element14; ComponentLink3URL: https://datasheet.ciiva.com/46440/1868787-46440889.pdf?src-supplier=Element14; ComponentLink3Description: https://datasheet.ciiva.com/46440/1868787-46440889.pdf?src-supplier=Element14; ComponentLink4URL: https://datasheet.ciiva.com/7746/1738695-7746234.pdf?src-supplier=Element14; ComponentLink4Description: https://datasheet.ciiva.com/7746/1738695-7746234.pdf?src-supplier=Element14; ComponentLink5URL: https://datasheet.ciiva.com/7746/1738695-7746235.pdf?src-supplier=Element14; ComponentLink5Description: https://datasheet.ciiva.com/7746/1738695-7746235.pdf?src-supplier=Element14; ComponentLink6URL: https://datasheet.ciiva.com/22747/443971-22747516.pdf?src-supplier=Element14; ComponentLink6Description: https://datasheet.ciiva.com/22747/443971-22747516.pdf?src-supplier=Element14; Parameter 1: *; JLCPCB Part #: C25803
R124 = CMP-2100-03662-1: ±1% ±100ppm/℃ 10kΩ 0.1W 0603 Chip Resistor - Surface Mount ROHS; Manufacturer: Yageo; Manufacturer Part Number: RC0603FR-07100KL; Power Rating: 100mW; Voltage Rating: 50V; Resistance: 100KOhm; Temperature Coefficient: 100ppm/degreesC; Working Voltage: 75V; Datasheet Version: Rev. 5, 10/2016; Height: 0.45mm; Lead Free: LeadFree; Manufacturer URL: http://www.yageo.com/; Package Reference: 0603; Depth: 0.8mm; RoHSCompliant: true; Composition: ThickFilm; Military Standard: Not; Case/Package: 0603; Packaging: TapeandReel; Case Code (Imperial): 0603; Voltage Rating (DC): 50V; Case Code (Metric): 1608; Tolerance: 1%; Termination: SMD/SMT; Min Operating Temperature: -55degC; Number of Pins: 2; Length: 1.6mm; Width: 0.8mm; Datasheet URL: http://www.yageo.com/NewPortal/yageodocoutput?fileName=/pdf/R-Chip/PYu-RC_Group_51_RoHS_L_5.pdf; Package Description: 2-Pin Surface Mount Device, Body 1.6 x 0.8 mm; Max Operating Temperature: 155degC; REACH SVHC: NoSVHC; Supplier 1: Digi-Key; Supplier Part Number 1: 311-100KHRCT-ND; RoHS: Yes; Category: Chip SMD Resistors; Stock 1: 19283456; Pricing 1: 1=0.10000, 10=0.02400, 100=0.00970, 1000=0.00436, 2500=0.00378 (USD); Series: RC; Max Power Dissipation: 100mW; Resistor Type: Thick Film; Number of Terminations: 2; Resistance Tolerance: 1%; Features: Moisture Resistant; Construction: Rectangular; Technology: THICK FILM; RoHS Compliant: Yes; ComponentLink1URL: https://datasheet.ciiva.com/11808/0900766b80f96399-11808107.pdf?src-supplier=RSComponents; ComponentLink1Description: https://datasheet.ciiva.com/11808/0900766b80f96399-11808107.pdf?src-supplier=RSComponents; ComponentLink2URL: https://datasheet.ciiva.com/7983/443971-7983593.pdf?src-supplier=Element14; ComponentLink2Description: https://datasheet.ciiva.com/7983/443971-7983593.pdf?src-supplier=Element14; ComponentLink3URL: https://datasheet.ciiva.com/46440/1868787-46440889.pdf?src-supplier=Element14; ComponentLink3Description: https://datasheet.ciiva.com/46440/1868787-46440889.pdf?src-supplier=Element14; ComponentLink4URL: https://datasheet.ciiva.com/7746/1738695-7746234.pdf?src-supplier=Element14; ComponentLink4Description: https://datasheet.ciiva.com/7746/1738695-7746234.pdf?src-supplier=Element14; ComponentLink5URL: https://datasheet.ciiva.com/7746/1738695-7746235.pdf?src-supplier=Element14; ComponentLink5Description: https://datasheet.ciiva.com/7746/1738695-7746235.pdf?src-supplier=Element14; ComponentLink6URL: https://datasheet.ciiva.com/22747/443971-22747516.pdf?src-supplier=Element14; ComponentLink6Description: https://datasheet.ciiva.com/22747/443971-22747516.pdf?src-supplier=Element14; Parameter 1: *; JLCPCB Part #: C25804
U16 = CMP-2000-05006-2: IC FLASH 32M SPI 104MHZ 8SOIC; Manufacturer: Winbond; Obsolete Part: true; Access Time: 7ns; Nominal Supply Current: 8-20mA; Memory Size: 32Mbits; Max Supply Voltage: 3.6V; Min Supply Voltage: 2.7V; Standoff Height: 0.05mm; Interface: SPI,Other; Package: SS; Memory Type: FLASH; Ipc Land Pattern Name: SOIC127P790X195-8; Temperature Range High: +85°C; Temperature: -40°C to +85°C; Octopart: https://octopart.com/w25q32fvssig-winbond-23896462; Manufacturer Part Number: W25Q32FVSSIG; Ambient Temperature Range Low: -40°C; Lead Free: Yes; Height: 2.16mm; Automotive: No; Device Class L2: Memory; Digikey Description: IC FLASH 32M SPI 104MHZ 8SOIC; RoHS: TRUE; Frequency: 104MHz; Ambient Temperature Range High: +85°C; ComponentLink2Description: Datasheet; Category: IC; Device Class L1: Integrated Circuits (ICs); Device Class L3: Flash; Temperature Range Low: -40°C; Footprint Url: http://www.winbond.com/resource-files/an0000009%20spiflash%20pcb%20layout%20guideline%20v2.0%2009252017.pdf?__locale=en; ComponentLink2URL: https://www.winbond.com/resource-files/w25q32fv%20revj%2006032016.pdf; Parameter 1: *; JLCPCB Part #: *
U21 = CMP-2000-07453-1: Low-Power, Highly-Integrated Wi-Fi Solution, 2.5 to 3.6 V, 80 mA, -40 to 125 degC, 32-Pin QFN; Manufacturer: Espressif Systems; Mounting Technology: SurfaceMount; Datasheet URL: http://espressif.com/sites/default/files/documentation/0a-esp8266ex_datasheet_en.pdf; Package Reference: QFN-32; Package Description: 32-Pin Quad Falt No-Lead, Body 5 x 5 mm, Pitch 0.5 mm; Manufacturer URL: http://espressif.com; Datasheet Version: Rev. 5.4, 04/2017; Parameter 1: *
Wi-Fi = CMP-1426-00002-1: SMD mono-color Chip LED, WL-SMCW, Green; Manufacturer: Wuerth Elektronik; ComponentLink1URL: http://www.we-online.com; ComponentLink2Description: Datasheet; Color: Green; ComponentLink2URL: http://katalog.we-online.com/led/datasheet/150060GS75000.pdf; PartNumber: 150060GS75000; PackageReference: 0603_A; ComponentLink1Description: Manufacturer URL; Parameter 1: *; JLCPCB Part #: *
XTL1 = CMP-0614-00001-1: Crystal Unit, 8 pF, 25000 kHz, -10 to 70 degC, 4-Pin 3.2 x 2.5 x 0.8 mm SMD, RoHS, Tape and Reel; Manufacturer: Kyocera; PartNumber: CX3225GB25000D0HEQCC; Load Capacitance: 8 pF; Frequency Tolerance: +/- 20 x 10^(-6); Operationg Temperature: -10 to 70 degC; PackageDescription: 4-Pin SMT, Body 3.2 x 2.5 mm, Height 0.9 mm; PackageVersion: Sep-13; PackageReference: CX3225GB-4; ComponentLink2Description: Datasheet; Series: CX3225GB; DatasheetVersion: Sep-13; ComponentLink2URL: http://global.kyocera.com/prdct/electro/pdf/xtal/cx3225gb_cs_e.pdf; ComponentLink3Description: Package Specification; ComponentLink1URL: http://global.kyocera.com/; ComponentLink3URL: http://global.kyocera.com/prdct/electro/pdf/xtal/cx3225gb_cs_e.pdf; Mounting Technology: Surface Mount; Frequency: 25000 kHz; Packing: Tape and Reel; ComponentLink1Description: Manufacturer URL; RoHS: TRUE; Parameter 1: *; JLCPCB Part #: *

## Nets that join several sheets
GND: Power_Stage (32 pins), MCU (76 pins), ISO_IO (23 pins), ISO_Power (12 pins), HV_BUCK_V2 (22 pins), LV_BUCK (24 pins), CAN (C87.1 U15.4), WIFI (24 pins)
V_3A: Power_Stage (C110.2 U11.6), MCU (7 pins), LV_BUCK (C69.2 FB3.2 TP6.1)
V_3V3D: MCU (26 pins), ISO_IO (9 pins), HV_BUCK_V2 (R118.2), LV_BUCK (C73.2 FB4.2 R41.2 TP8.1), CAN (C87.2 U15.1), WIFI (5 pins)
V_5: HV_BUCK_V2 (R66.2), LV_BUCK (10 pins)
V_12: Power_Stage (6 pins), MCU (R78.2), ISO_IO (CONN_REL.1), ISO_Power (C88.1 C98.2 FB8.1 FB9.2), HV_BUCK_V2 (C124.2 FB2.2 R10.2 TP10.1), LV_BUCK (C33.2 C61.2 R46.2 U4.1)
V_PV: Power_Stage (16 pins), MCU (FB1.1 R28.1), HV_BUCK_V2 (C128.2 L4.2)
V_PVin: Power_Stage (D0.2 PV+.1 R8.1), MCU (CMC1.1 R25.1)
COMP1_INP: Power_Stage (C112.2 R80.2 TP12.1), MCU (U1.39 U1.40)
DAC1_OUT1: Power_Stage (R63.1), MCU (R39.2)
HRTIM1_CHA1: Power_Stage (R14.1), MCU (U1.89), ISO_IO (R95.1)
HRTIM1_CHA2: Power_Stage (R55.1), MCU (U1.90)
HRTIM1_CHB1: Power_Stage (R49.1), MCU (U1.91)
HRTIM1_CHB2: Power_Stage (R51.1), MCU (U1.92)
HRTIM1_CHE2: MCU (U1.88), ISO_IO (R83.1 R117.2 R130.1 TP31.1)
HRTIM1_CHF1: MCU (TP1.1 U1.80), ISO_IO (U17.2)
HRTIM1_CHF2: MCU (TP2.1 U1.81), ISO_IO (CONN_BOTT.9)
NetC89_2: MCU (U1.75), ISO_IO (C89.2 R110.1)
NetC95_2: MCU (U1.99), ISO_IO (C95.2 R36.1 R37.1 TP21.1)
NetC130_2: MCU (U1.77), ISO_IO (C130.2 R112.1)
NetCONN_BOTT_3: MCU (U1.101), ISO_IO (CONN_BOTT.3)
NetCONN_BOTT_4: MCU (U1.107), ISO_IO (CONN_BOTT.4)
NetCONN_BOTT_6: MCU (U1.102), ISO_IO (CONN_BOTT.6)
NetCONN_BOTT_12: MCU (U1.83), ISO_IO (CONN_BOTT.12 R127.1)
NetCONN_IND_1: MCU (U1.5), ISO_IO (CONN_IND.1)
NetCONN_IND_3: MCU (U1.4), ISO_IO (CONN_IND.3)
NetCONN_IND_5: MCU (U1.1), ISO_IO (CONN_IND.5)
NetCONN_REL_3: MCU (R107.1 R108.1), ISO_IO (CONN_REL.3)
NetESP_PROG_2: MCU (U1.69), WIFI (ESP_PROG.2 R61.2)
NetESP_PROG_3: MCU (U1.71), WIFI (ESP_PROG.3 R119.2)
NetESP_PROG_4: MCU (U1.70), WIFI (ESP_PROG.4 R120.2)
NetR34_1: MCU (U1.59), ISO_IO (R34.1 R35.1 R69.2 TP27.1)
NetR41_1: MCU (U1.3), LV_BUCK (R41.1 U4.5)
NetR70_2: MCU (U1.61), ISO_IO (R70.2 R128.1)
NetR77_2: MCU (U1.124), ISO_Power (R77.2 U19.2)
NetR94_2: MCU (U1.72), WIFI (R94.2)
NetR106_2: MCU (U1.112), ISO_Power (R106.2)
NetR111_2: MCU (TP3.1 U1.114), ISO_IO (R111.2)
NetR116_2: MCU (U1.76), ISO_IO (R116.2 R129.1 TP29.1)
NetR118_1: MCU (U1.117), HV_BUCK_V2 (R118.1 U9.1)
NetR125_1: MCU (R125.1 TP18.1 U1.58), ISO_IO (R132.2 U17.1 U18.1)
NetR126_1: MCU (TP4.1 U1.113), ISO_IO (R126.1)
NetR129_2: MCU (U1.126), ISO_IO (R129.2)
NetR130_2: MCU (U1.125), ISO_IO (R130.2)
NetU1_2: MCU (U1.2), ISO_IO (U18.2)
NetU1_108: MCU (U1.108), CAN (U15.3)
NetU1_109: MCU (U1.109), CAN (U15.2)
SPI1_MISO: MCU (P2.1 R42.2 U1.85), WIFI (R105.1)
SPI1_MOSI: MCU (P2.4 R1.2 U1.86), WIFI (R88.1)
USART2_RX_STM32: MCU (U1.116), ISO_IO (R128.2)
USART2_TX_STM32: MCU (U1.115), ISO_IO (R127.2)